# Altium project MiniRobot.PrjPcb
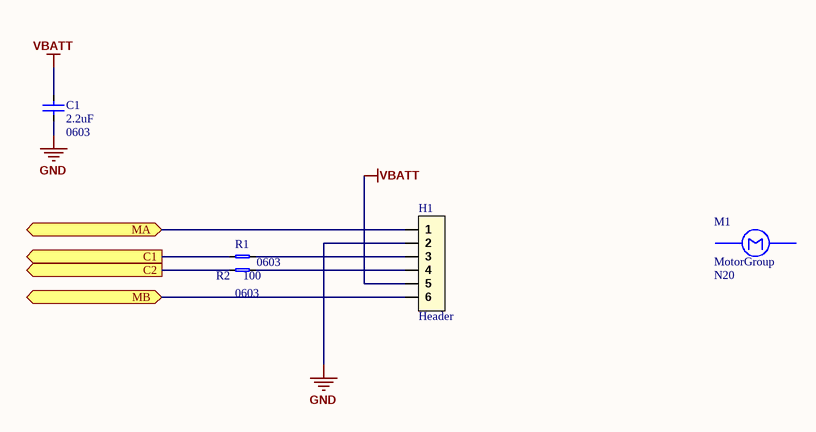
[diagram p0: MR_Motor.SchDoc]
6 sheets, 46 parts. Net scope: flat (ports and power ports of the same name join across sheets).
Board file: MiniRobot.PcbDoc
Sheets:
  MR_Motor.SchDoc
  MR_Motor_Control.SchDoc
  MR_Mcu.SchDoc
  MR_Power.SchDoc
  MR_RangeSensor.SchDoc
  MR_UartConnector.SchDoc

## Sheet MR_Motor.SchDoc
size A4; CompanyName: BeeIonic; SheetNumber: 2; SheetTotal: 7

### Parts
C1  value 2.2uF  Package: 0603  [0603_CAP_LD]  (hidden comment: CerCap)
H1  Header  [HEADER_1X6_PICOBLADE_653106124022]
M1  MotorGroup  Reference: N20  [MotorGroup]
R1  Package: 0603  [0603_RES_LD]  (hidden comment: Resistor)
R2  value 100  Package: 0603  [0603_RES_LD]  (hidden comment: Resistor)

### Ports
C1 (out), C2 (out), MA (bidir), MB (bidir)

### Nets
GND: C1.1 H1.2
VBATT: C1.2 H1.5
NetH1_1: H1.1 ; port MA
NetH1_3: H1.3 R1.2
NetH1_4: H1.4 R2.2
NetH1_6: H1.6 ; port MB
NetR1_1: R1.1 ; port C1
NetR2_1: R2.1 ; port C2

### Notes on the sheet
- Project :
- Title :
- Sheet:
- of
- Creation Date :
- Designer :
- Modified Date :

### Library data of the parts
C1 = CerCap: Ceramic Capacitor; Type: *; Voltage/Power: *
H1 = Header_6x1: Header 6x1 Pins
M1 = Motor
R1 = Resistor: Value: 100; Precision: *
R2 = Resistor: Precision: *

## Sheet MR_Motor_Control.SchDoc
size A4; CompanyName: BeeIonic; SheetNumber: 3; SheetTotal: 7
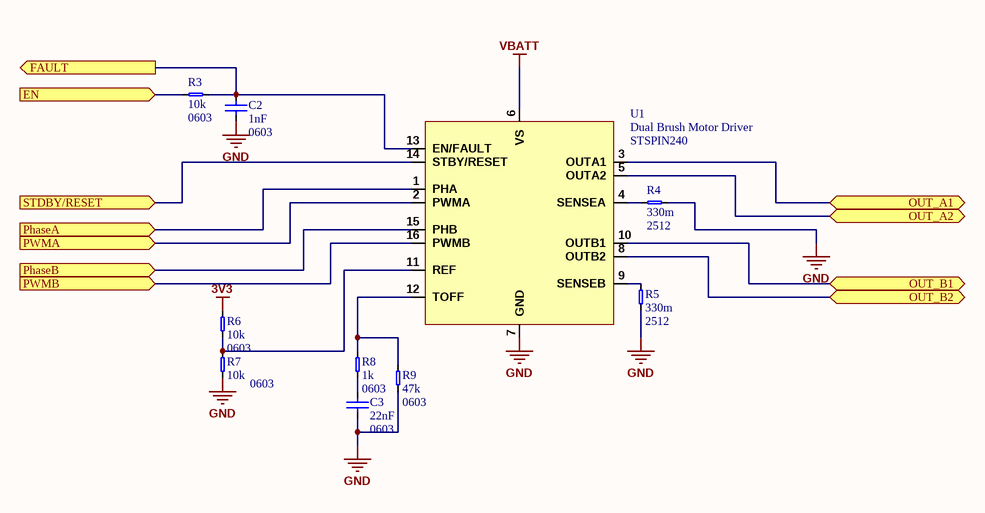
[diagram p1: MR_Motor_Control.SchDoc]

### Parts
C2  value 1nF  Package: 0603  [0603_CAP_LD]  (hidden comment: CerCap)
C3  value 22nF  Package: 0603  [0603_CAP_LD]  (hidden comment: CerCap)
R3  value 10k  Package: 0603  [0603_RES_LD]  (hidden comment: Resistor)
R4  value 330m  Package: 2512  [2512_RES_LD]  (hidden comment: Resistor)
R5  value 330m  Package: 2512  [2512_RES_LD]  (hidden comment: Resistor)
R6  value 10k  Package: 0603  [0603_RES_LD]  (hidden comment: Resistor)
R7  value 10k  Package: 0603  [0603_RES_LD]  (hidden comment: Resistor)
R8  value 1k  Package: 0603  [0603_RES_LD]  (hidden comment: Resistor)
R9  value 47k  Package: 0603  [0603_RES_LD]  (hidden comment: Resistor)
U1  Dual Brush Motor Driver  [QFN-STSPIN240]

### Ports
EN (in), FAULT (out), OUT_A1 (bidir), OUT_A2 (bidir), OUT_B1 (bidir), OUT_B2 (bidir), PhaseA (in), PhaseB (in), PWMA (in), PWMB (in), STDBY/RESET (in)

### Nets
3V3: R6.1
GND: C2.1 C3.1 R4.1 R5.1 R7.2 R9.1 U1.7(GND)
VBATT: U1.6(VS)
NetC2_2: C2.2 R3.2 U1.13(EN/FAULT) ; port FAULT
NetC3_2: C3.2 R8.1
NetR3_1: R3.1 ; port EN
NetR4_2: R4.2 U1.4(SENSEA)
NetR5_2: R5.2 U1.9(SENSEB)
NetR6_2: R6.2 R7.1 U1.11(REF)
NetR8_2: R8.2 R9.2 U1.12(TOFF)
NetR18_1: U1.10(OUTB1) ; port OUT_B1
NetU1_1: U1.1(PHA) ; port PhaseA
NetU1_2: U1.2(PWMA) ; port PWMA
NetU1_3: U1.3(OUTA1) ; port OUT_A1
NetU1_5: U1.5(OUTA2) ; port OUT_A2
NetU1_8: U1.8(OUTB2) ; port OUT_B2
NetU1_14: U1.14(STBY/RESET) ; port STDBY/RESET
NetU1_15: U1.15(PHB) ; port PhaseB
NetU1_16: U1.16(PWMB) ; port PWMB

### Notes on the sheet
- Project :
- Title :
- Sheet:
- of
- Creation Date :
- Designer :
- Modified Date :

### Library data of the parts
C2 C3 = CerCap: Ceramic Capacitor; Type: *; Voltage/Power: *
U1 = STSPIN240: ST Dual Motor Driver; Reference: STSPIN240
R3-R9 = Resistor: Precision: *

## Sheet MR_Mcu.SchDoc
size A4; CompanyName: BeeIonic; SheetNumber: 4; SheetTotal: 7
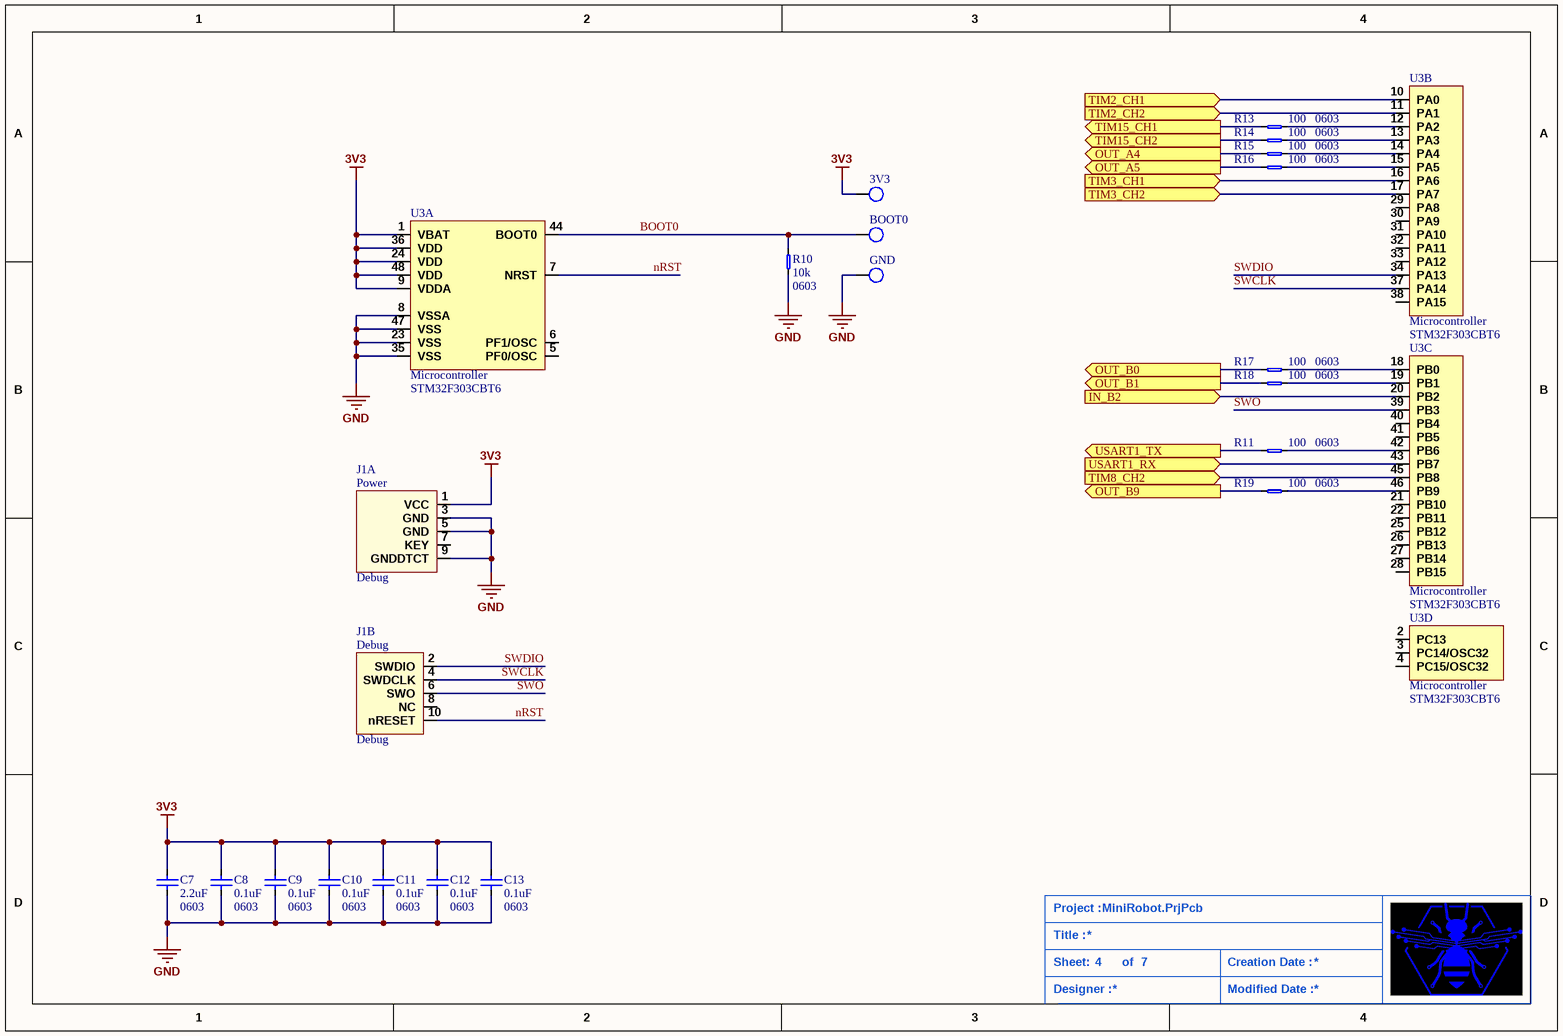
[diagram p2: MR_Mcu.SchDoc]

### Parts
3V3  TestPoint  [ROUND_TEST_POINT]  (value not drawn)  (no BOM)
BOOT0  TestPoint  [ROUND_TEST_POINT]  (value not drawn)  (no BOM)
C7  value 2.2uF  Package: 0603  [0603_CAP_LD]  (hidden comment: CerCap)
C8  value 0.1uF  Package: 0603  [0603_CAP_LD]  (hidden comment: CerCap)
C9  value 0.1uF  Package: 0603  [0603_CAP_LD]  (hidden comment: CerCap)
C10  value 0.1uF  Package: 0603  [0603_CAP_LD]  (hidden comment: CerCap)
C11  value 0.1uF  Package: 0603  [0603_CAP_LD]  (hidden comment: CerCap)
C12  value 0.1uF  Package: 0603  [0603_CAP_LD]  (hidden comment: CerCap)
C13  value 0.1uF  Package: 0603  [0603_CAP_LD]  (hidden comment: CerCap)
GND  TestPoint  [ROUND_TEST_POINT]  (value not drawn)  (no BOM)
J1  Debug  [62201021121]  (parts A,B of 2)
R10  value 10k  Package: 0603  [0603_RES_LD]  (hidden comment: Resistor)
R11  value 100  Package: 0603  [0603_RES_LD]  (hidden comment: Resistor)
R13  value 100  Package: 0603  [0603_RES_LD]  (hidden comment: Resistor)
R14  value 100  Package: 0603  [0603_RES_LD]  (hidden comment: Resistor)
R15  value 100  Package: 0603  [0603_RES_LD]  (hidden comment: Resistor)
R16  value 100  Package: 0603  [0603_RES_LD]  (hidden comment: Resistor)
R17  value 100  Package: 0603  [0603_RES_LD]  (hidden comment: Resistor)
R18  value 100  Package: 0603  [0603_RES_LD]  (hidden comment: Resistor)
R19  value 100  Package: 0603  [0603_RES_LD]  (hidden comment: Resistor)
U3  Microcontroller  [STM32_LQFP48]  (parts A,B,C,D of 4)

### Ports
IN_B2 (in), OUT_A4 (out), OUT_A5 (out), OUT_B0 (out), OUT_B1 (out), OUT_B9 (out), TIM2_CH1 (in), TIM2_CH2 (in), TIM3_CH1 (in), TIM3_CH2 (in), TIM8_CH2 (in), TIM15_CH1 (out), TIM15_CH2 (out), USART1_RX (in), USART1_TX (out)

### Nets
3V3: 3V3.1(TP) C7.2 C8.2 C9.2 C10.2 C11.2 C12.2 C13.2 J1.1(VCC) U3.1(VBAT) U3.9(VDDA) U3.24(VDD) U3.36(VDD) U3.48(VDD)
GND: C7.1 C8.1 C9.1 C10.1 C11.1 C12.1 C13.1 GND.1(TP) J1.3(GND) J1.5(GND) J1.9(GNDDTCT) R10.1 U3.8(VSSA) U3.23(VSS) U3.35(VSS) U3.47(VSS)
BOOT0: BOOT0.1(TP) R10.2 U3.44(BOOT0)
nRST: J1.10(nRESET) U3.7(NRST)
SWCLK: J1.4(SWDCLK) U3.37(PA14)
SWDIO: J1.2(SWDIO) U3.34(PA13)
SWO: J1.6(SWO) U3.39(PB3)
NetR11_1: R11.1 ; port USART1_TX
NetR11_2: R11.2 U3.42(PB6)
NetR13_1: R13.1 ; port TIM15_CH1
NetR13_2: R13.2 U3.12(PA2)
NetR14_1: R14.1 ; port TIM15_CH2
NetR14_2: R14.2 U3.13(PA3)
NetR15_1: R15.1 ; port OUT_A4
NetR15_2: R15.2 U3.14(PA4)
NetR16_1: R16.1 ; port OUT_A5
NetR16_2: R16.2 U3.15(PA5)
NetR17_1: R17.1 ; port OUT_B0
NetR17_2: R17.2 U3.18(PB0)
NetR18_1: R18.1 ; port OUT_B1
NetR18_2: R18.2 U3.19(PB1)
NetR19_1: R19.1 ; port OUT_B9
NetR19_2: R19.2 U3.46(PB9)
NetU3_10: U3.10(PA0) ; port TIM2_CH1
NetU3_11: U3.11(PA1) ; port TIM2_CH2
NetU3_16: U3.16(PA6) ; port TIM3_CH1
NetU3_17: U3.17(PA7) ; port TIM3_CH2
NetU3_20: U3.20(PB2) ; port IN_B2
NetU3_43: U3.43(PB7) ; port USART1_RX
NetU3_45: U3.45(PB8) ; port TIM8_CH2

Not connected (* = marked no-connect by the designer): J1 7(KEY) 8(NC); U3 2(PC13) 3(PC14/OSC32) 4(PC15/OSC32) 5(PF0/OSC) 6(PF1/OSC) 21(PB10) 22(PB11) 25(PB12) 26(PB13) 27(PB14) 28(PB15) 29(PA8) 30(PA9) 31(PA10) 32(PA11) 33(PA12) 38(PA15) 40(PB4) 41(PB5)

### Notes on the sheet
- Project :
- Title :
- Sheet:
- of
- Creation Date :
- Designer :
- Modified Date :
- (in symbol Cortex_10x2, part A) Power

### Library data of the parts
C7-C13 = CerCap: Ceramic Capacitor; Type: *; Voltage/Power: *
J1 = Cortex_10x2: Cortex 10 pins Debug Connector
U3 = STM32F303CBT6: STM32F303 Microcontroller; Reference: STM32F303CBT6
R10 R11 R13-R19 = Resistor: Precision: *

## Sheet MR_Power.SchDoc
size A4; CompanyName: BeeIonic; SheetNumber: 5; SheetTotal: 7
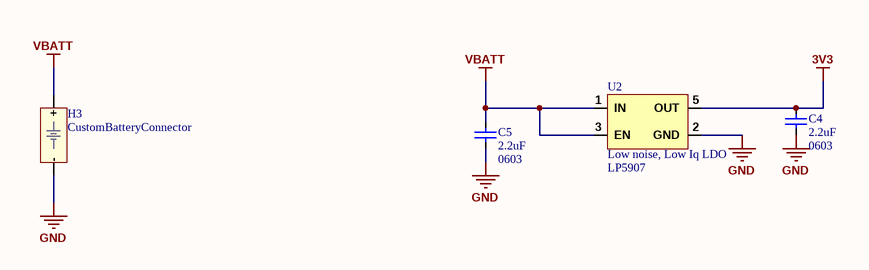
[diagram p3: MR_Power.SchDoc]

### Parts
C4  value 2.2uF  Package: 0603  [0603_CAP_LD]  (hidden comment: CerCap)
C5  value 2.2uF  Package: 0603  [0603_CAP_LD]  (hidden comment: CerCap)
H3  CustomBatteryConnector  [CustomBatteryConnector]
U2  Low noise, Low Iq LDO  [LP5907]

### Nets
3V3: C4.2 U2.5(OUT)
GND: C4.1 C5.1 H3.- U2.2(GND)
VBATT: C5.2 H3.+ U2.1(IN) U2.3(EN)

Not connected (* = marked no-connect by the designer): U2 4(NC)

### Notes on the sheet
- Project :
- Title :
- Sheet:
- of
- Creation Date :
- Designer :
- Modified Date :

### Library data of the parts
C4 C5 = CerCap: Ceramic Capacitor; Type: *; Voltage/Power: *
H3 = BatteryConnector: Custom Battery Connector
U2 = LP5907: LP5907 Low Noise Low Iq LDO; Reference: LP5907

## Sheet MR_RangeSensor.SchDoc
size A4; CompanyName: BeeIonic; SheetNumber: 6; SheetTotal: 7
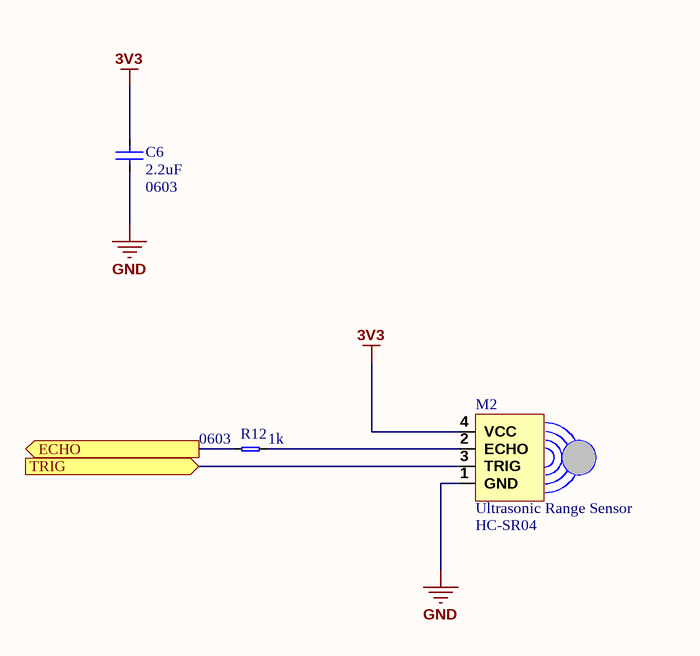
[diagram p4: MR_RangeSensor.SchDoc]

### Parts
C6  value 2.2uF  Package: 0603  [0603_CAP_LD]  (hidden comment: CerCap)
M2  Ultrasonic Range Sensor  [HC-SR04]
R12  value 1k  Package: 0603  [0603_RES_LD]  (hidden comment: Resistor)

### Ports
ECHO (out), TRIG (in)

### Nets
3V3: C6.2 M2.4(VCC)
GND: C6.1 M2.1(GND)
NetM2_2: M2.2(ECHO) R12.2
NetM2_3: M2.3(TRIG) ; port TRIG
NetR12_1: R12.1 ; port ECHO

### Notes on the sheet
- Project :
- Title :
- Sheet:
- of
- Creation Date :
- Designer :
- Modified Date :

### Library data of the parts
C6 = CerCap: Ceramic Capacitor; Type: *; Voltage/Power: *
M2 = HC-SR04: Reference: HC-SR04
R12 = Resistor: Precision: *

## Sheet MR_UartConnector.SchDoc
size A4; CompanyName: BeeIonic; SheetNumber: 7; SheetTotal: 7
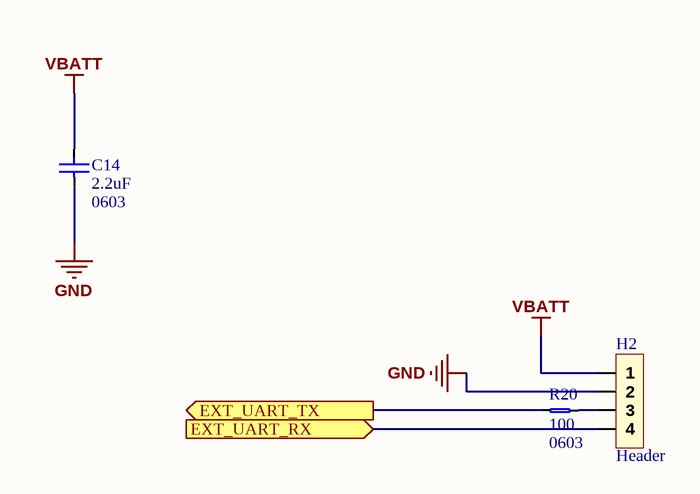
[diagram p5: MR_UartConnector.SchDoc]

### Parts
C14  value 2.2uF  Package: 0603  [0603_CAP_LD]  (hidden comment: CerCap)
H2  Header  [HE14 1x4 Straight]
R20  value 100  Package: 0603  [0603_RES_LD]  (hidden comment: Resistor)

### Ports
EXT_UART_RX (in), EXT_UART_TX (out)

### Nets
GND: C14.1 H2.2
VBATT: C14.2 H2.1
NetH2_3: H2.3 R20.2
NetH2_4: H2.4 ; port EXT_UART_RX
NetR20_1: R20.1 ; port EXT_UART_TX

### Notes on the sheet
- Project :
- Title :
- Sheet:
- of
- Creation Date :
- Designer :
- Modified Date :

### Library data of the parts
C14 = CerCap: Ceramic Capacitor; Type: *; Voltage/Power: *
H2 = Header_4x1: Header 4x1 PIns
R20 = Resistor: Precision: *

## Nets that join several sheets
3V3: MR_Motor_Control (R6.1), MR_Mcu (14 pins), MR_Power (C4.2 U2.5), MR_RangeSensor (C6.2 M2.4)
GND: MR_Motor (C1.1 H1.2), MR_Motor_Control (7 pins), MR_Mcu (16 pins), MR_Power (C4.1 C5.1 H3.- U2.2), MR_RangeSensor (C6.1 M2.1), MR_UartConnector (C14.1 H2.2)
VBATT: MR_Motor (C1.2 H1.5), MR_Motor_Control (U1.6), MR_Power (C5.2 H3.+ U2.1 U2.3), MR_UartConnector (C14.2 H2.1)
NetR18_1: MR_Motor_Control (U1.10), MR_Mcu (R18.1)